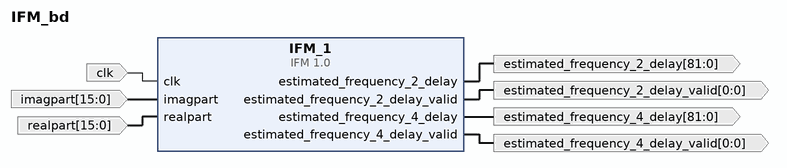
[diagram p0: block diagram of the top level]
# Vivado block design IFM_bd, xczu9eg-ffvb1156-2-e, Vivado 2025.1
create_bd_design IFM_bd

create_bd_port -dir I -type clk clk
create_bd_port -dir O -from 81 -to 0 -type data estimated_frequency_2_delay
create_bd_port -dir O -from 0 -to 0 -type data estimated_frequency_2_delay_valid
create_bd_port -dir O -from 81 -to 0 -type data estimated_frequency_4_delay
create_bd_port -dir O -from 0 -to 0 -type data estimated_frequency_4_delay_valid
create_bd_port -dir I -from 15 -to 0 -type data imagpart
create_bd_port -dir I -from 15 -to 0 -type data realpart

create_bd_cell -type ip -vlnv FSY:VMC:IFM:1.0 IFM_1

# ---- connections ----

connect_bd_net [get_bd_pins IFM_1/estimated_frequency_2_delay] [get_bd_ports estimated_frequency_2_delay]
connect_bd_net [get_bd_pins IFM_1/estimated_frequency_2_delay_valid] [get_bd_ports estimated_frequency_2_delay_valid]
connect_bd_net [get_bd_pins IFM_1/estimated_frequency_4_delay] [get_bd_ports estimated_frequency_4_delay]
connect_bd_net [get_bd_pins IFM_1/estimated_frequency_4_delay_valid] [get_bd_ports estimated_frequency_4_delay_valid]
connect_bd_net [get_bd_ports clk] [get_bd_pins IFM_1/clk]
connect_bd_net [get_bd_ports imagpart] [get_bd_pins IFM_1/imagpart]
connect_bd_net [get_bd_ports realpart] [get_bd_pins IFM_1/realpart]

validate_bd_design
save_bd_design
